# Altium schematic sheet ESP8266.SchDoc
size A4
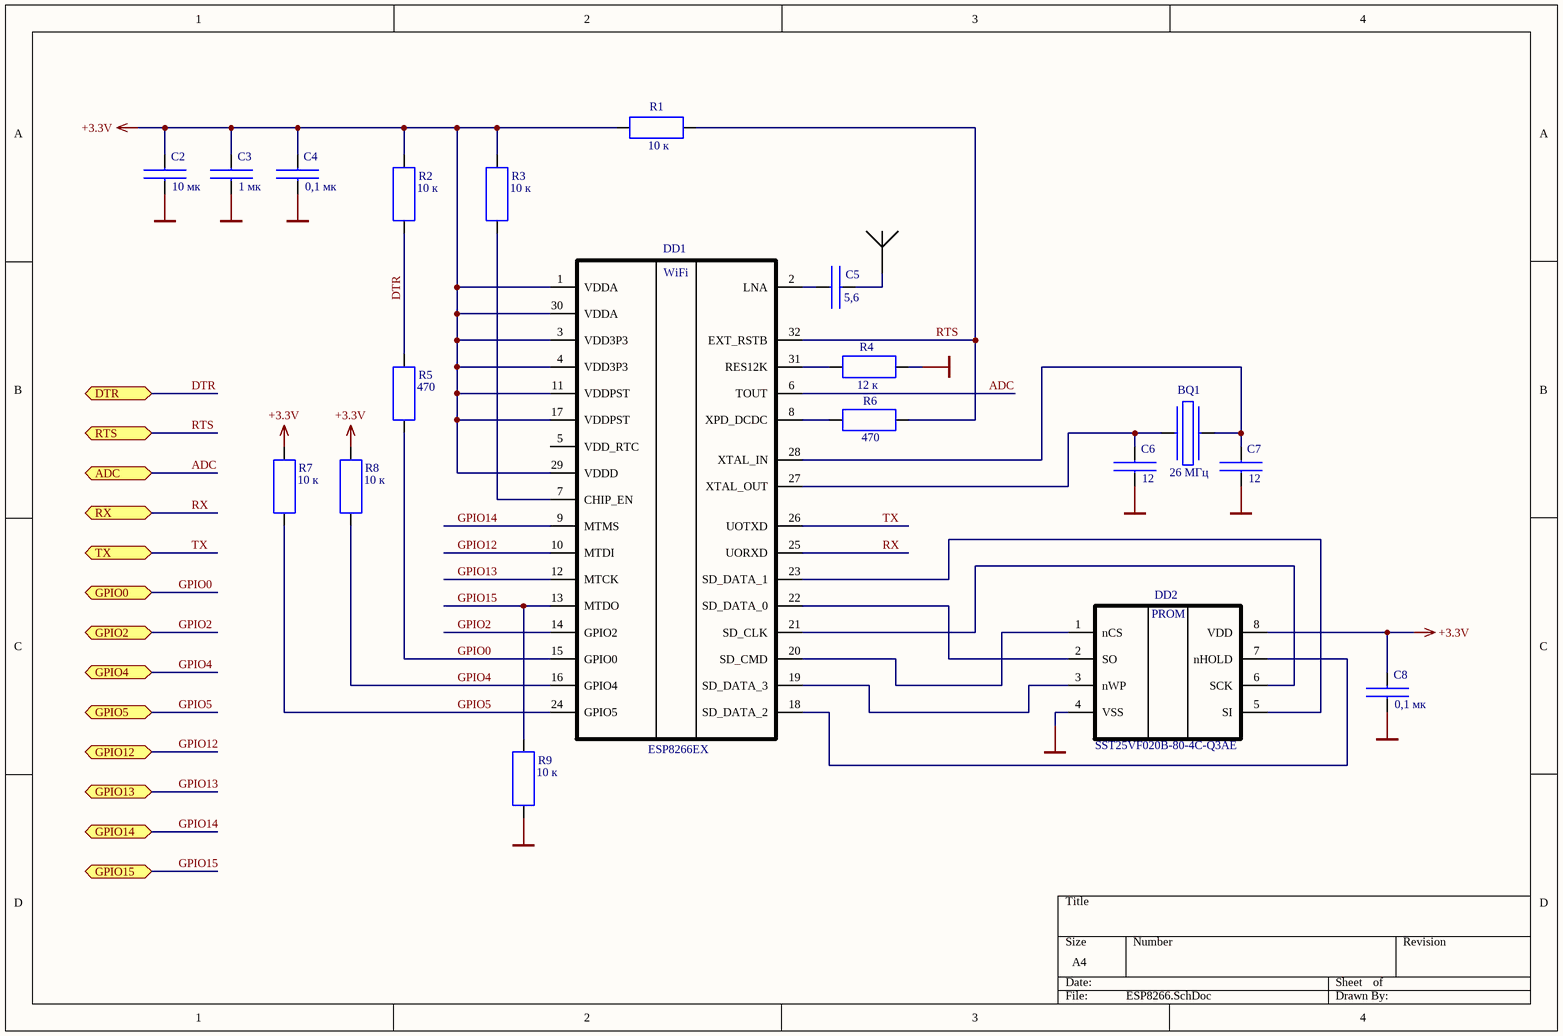
[diagram p0: ESP8266.SchDoc]

## Parts
A1  2.4 GHz  [Ant_2.4G]  (value not drawn)
BQ1  26 МГц  [OSC2520]
C2  10 мк  [CC1608(0603)x09]
C3  1 мк  [CC1608(0603)x09]
C4  0,1 мк  [CC1608(0603)x09]
C5  5,6  [CC1608(0603)x09]
C6  12  [CC1608(0603)x09]
C7  12  [CC1608(0603)x09]
C8  0,1 мк  [CC1608(0603)x09]
DD1  ESP8266EX  [QFN50P500X500X90_HS-33N]
DD2  SST25VF020B-80-4C-Q3AE  [SON127P600-8N]
R1  10 к  [RC1608(0603)x06]
R2  10 к  [RC1608(0603)x06]
R3  10 к  [RC1608(0603)x06]
R4  12 к  [RC1608(0603)x06]
R5  470  [RC1608(0603)x06]
R6  470  [RC1608(0603)x06]
R7  10 к  [RC1608(0603)x06]
R8  10 к  [RC1608(0603)x06]
R9  10 к  [RC1608(0603)x06]

## Ports
ADC, DTR, GPIO0, GPIO2, GPIO4, GPIO5, GPIO12, GPIO13, GPIO14, GPIO15, RTS, RX, TX

## Nets
+3.3V: C2.1 C3.1 C4.1 C8.1 DD1.1(VDDA) DD1.3(VDD3P3) DD1.4(VDD3P3) DD1.11(VDDPST) DD1.17(VDDPST) DD1.29(VDDD) DD1.30(VDDA) DD2.8(VDD) R1.2 R2.2 R3.2 R7.2 R8.2
GND: C2.2 C3.2 C4.2 C6.2 C7.2 C8.2 DD1.33(GND) DD2.4(VSS) R4.1 R9.1
ADC: DD1.6(TOUT) ; port ADC
DTR: R2.1 R5.2 ; port DTR
GPIO0: DD1.15(GPIO0) R5.1 ; port GPIO0
GPIO2: DD1.14(GPIO2) ; port GPIO2
GPIO4: DD1.16(GPIO4) R8.1 ; port GPIO4
GPIO5: DD1.24(GPIO5) R7.1 ; port GPIO5
GPIO12: DD1.10(MTDI) ; port GPIO12
GPIO13: DD1.12(MTCK) ; port GPIO13
GPIO14: DD1.9(MTMS) ; port GPIO14
GPIO15: DD1.13(MTDO) R9.2 ; port GPIO15
RTS: DD1.32(EXT_RSTB) R1.1 R6.1 ; port RTS
RX: DD1.25(UORXD) ; port RX
TX: DD1.26(UOTXD) ; port TX
NetA1_1: A1.1 C5.2
NetBQ1_1: BQ1.1 C6.1 DD1.27(XTAL_OUT)
NetBQ1_3: BQ1.3 C7.1 DD1.28(XTAL_IN)
NetC5_1: C5.1 DD1.2(LNA)
NetDD1_7: DD1.7(CHIP_EN) R3.1
NetDD1_8: DD1.8(XPD_DCDC) R6.2
NetDD1_18: DD1.18(SD_DATA_2) DD2.7(nHOLD)
NetDD1_19: DD1.19(SD_DATA_3) DD2.3(nWP)
NetDD1_20: DD1.20(SD_CMD) DD2.1(nCS)
NetDD1_21: DD1.21(SD_CLK) DD2.6(SCK)
NetDD1_22: DD1.22(SD_DATA_0) DD2.2(SO)
NetDD1_23: DD1.23(SD_DATA_1) DD2.5(SI)
NetDD1_31: DD1.31(RES12K) R4.2

Not connected (* = marked no-connect by the designer): DD1 5(VDD_RTC)

## Notes on the sheet
- (in symbol ESP8622EX) WiFi
- (in symbol SST25VF020B-80-4C-Q3AE) PROM

## Library data of the parts
A1 = Mean_Inverted_F_2.4G: 2.4 GHz PCB  Meandered  Inverted-F Antenna
BQ1 = OSC2520
C2-C8 = CC0603 X7R uF0.22 V25/16: Ceramic Chip-capacitor 0603; Name: Конденсатор 0603-0.22 мкФ X7R 25/16V; Voltage: 25 / 16; Vendor1: AVX Corporation; Vendor2: KEMET Electronics Corporation, USA; Vendor2Name: C0603C224K3RAC (25V), C0603C224K4RAC (16V); Ta: -55+125; Vendor3: Murata Manufacturing Co., Ltd, Japan; Vendor3Name: GRM188R71E224K (25V), GRM188R71C224K (16V); Vendor4: Panasonic (Matsushita Electric Co.), Japan; Vendor4Name: ECJ1VB1C224K (16V); Vendor5: Samsung, Korea; Vendor5Name: CL10B224KO8NNNC (16V); Vendor6: Taiyo Yuden Co., Ltd., Japan; Vendor6Name: EMK107BJ224KA-T (16V); Vendor7: TDK Corp., Japan; Vendor7Name: C1608X7R1E224K (25V); Vendor8: Vishay Intertechnology, Inc., USA; Vendor8Name: VJ0603Y224KXJCW1BC (16V); Vendor9: Yageo Corp., Taiwan; Vendor9Name: CC0603KRX7R7BN224 / 2238 786 15654 (16V); Type: Capacitor; Vendor1Name: N/A
DD1 = ESP8622EX
R1-R9 = 1% R0603-K15.0: Chip Resistor 0603; Name: Резистор 0603-15.0 кОм±1%; Vendor1: Bourns, Inc., USA; Vendor1Name: CR0603-FX-(RCode4dig)E(LF); Vendor2: KOA Speer Electronics, Inc., USA; Vendor2Name: RK73H1JT(L)TD(RCode4dig)F; Vendor3: NIC Components Corp., USA; Vendor3Name: NRC06F(RCode4dig)TRF; Ta: -55+125; Vendor4: Panasonic (Matsushita Electric Corporation), Japan; Vendor4Name: ERJ3EKF(RCode4dig)V; PowerRating: 0.1W; Vendor5: Rohm Co., Ltd., Japan; Vendor5Name: MCR03EZPFX(RCode4dig); Vendor6: Samsung, Korea; Vendor6Name: RC1608F(RCode4dig)CS; Vendor7: SEI Stackpole Electronics, Inc., USA; Vendor7Name: RMC1/16(RValue)1%R; Vendor8: Vishay Intertechnology, Inc., USA; Vendor8Name: CRCW0603(RCode1RKM)FKEA; Vendor9: Yageo Corporation, Taiwan; Vendor9Name: RC0603FR-07(RCode1RKM)L; Type: Resistor